# Altium project Power_Supply.PrjPcb
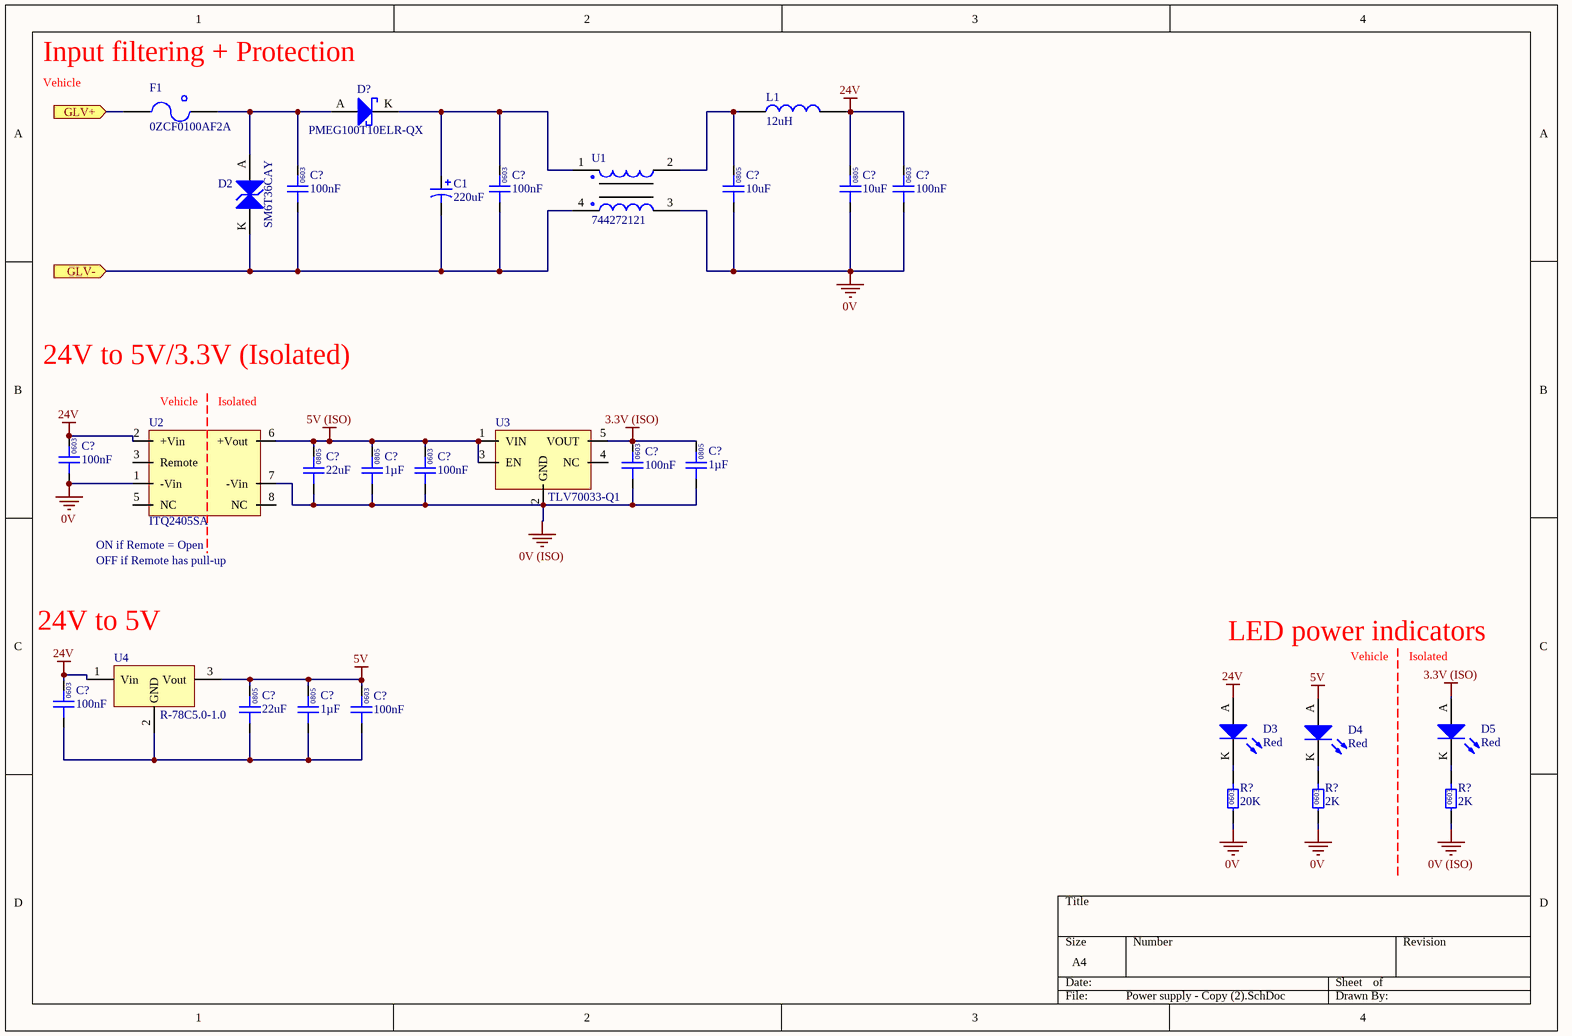
[diagram p0: Power supply - Copy (2).SchDoc]
1 sheet, 30 parts. Net scope: flat (ports and power ports of the same name join across sheets).
Board file: PCB1.PcbDoc

## Sheet Power supply - Copy (2).SchDoc
size A4; SheetNumber: 1; SheetTotal: 1

### Parts
(Parts that share a designator on the sheet are numbered #1, #2 ... from top to bottom, then left to right.)
C1  220uF  [Vishay Radial 1213]
C?#1  100nF  [0603]
C?#2  100nF  [0603]
C?#3  10uF  [0805]
C?#4  10uF  [0805]
C?#5  100nF  [0603]
C?#6  100nF  [0603]
C?#7  100nF  [0603]
C?#8  1µF  [0805]
C?#9  22uF  [0805]
C?#10  1µF  [0805]
C?#11  100nF  [0603]
C?#12  100nF  [0603]
C?#13  22uF  [0805]
C?#14  1µF  [0805]
C?#15  100nF  [0603]
D2  SM6T36CAY  [ST SMB DIODE]
D3  Red  [0805 LED]
D4  Red  [0805 LED]
D5  Red  [0805 LED]
D?  PMEG100T10ELR-QX  [NXP SOD123W]
F1  0ZCF0100AF2A  [2920]
L1  12uH  [1812]
R?#1  20K  [0603]
R?#2  2K  [0603]
R?#3  2K  [0603]
U1  744272121  [Wurth 4-PC Pad]
U2  ITQ2405SA  [8-SIP]
U3  TLV70033-Q1  [TI SOT-23-5]
U4  R-78C5.0-1.0  [RECOM 3-SIP]

### Ports
GLV+ (in), GLV- (in)

### Nets
0V: C?#3.1 C?#4.1 C?#5.1 C?#6.1 R?#1.1 R?#2.1 U1.3 U2.1(-Vin)
0V (ISO): C?#7.1 C?#8.1 C?#9.1 C?#10.1 C?#11.1 R?#3.1 U2.7(-Vin) U3.2(GND)
3.3V (ISO): C?#7.2 C?#8.2 D5.A U3.5(VOUT)
5V: C?#13.2 C?#14.2 C?#15.2 D4.A U4.3(Vout)
5V (ISO): C?#9.2 C?#10.2 C?#11.2 U2.6(+Vout) U3.1(VIN) U3.3(EN)
24V: C?#4.2 C?#5.2 C?#6.2 C?#12.2 D3.A L1.1 U2.2(+Vin) U4.1(Vin)
NetC1_1: C1.1 C?#1.1 C?#2.1 D2.K U1.4 ; port GLV-
NetC1_2: C1.2 C?#2.2 D?.K U1.1
NetC?#1_2: C?#1.2 D2.A D?.A F1.2
NetC?#3_2: C?#3.2 L1.2 U1.2
NetC?#12_1: C?#12.1 C?#13.1 C?#14.1 C?#15.1 U4.2(GND)
NetD3_K: D3.K R?#1.2
NetD4_K: D4.K R?#2.2
NetD5_K: D5.K R?#3.2
NetF1_1: F1.1 ; port GLV+

Not connected (* = marked no-connect by the designer): U2 3(Remote) 5(NC) 8(NC); U3 4(NC)

### Notes on the sheet
- Input filtering + Protection
- Vehicle
- 24V to 5V/3.3V (Isolated)
- (near U2) Vehicle
- (near U2) Isolated
- (near U2) ON if Remote = Open
- (near U2) OFF if Remote has pull-up
- 24V to 5V
- LED power indicators
- Isolated
- (in symbol GCM21BR71H105KA03L) 0805
- (in symbol GCM188L81H104KA57D) 0603
- (in symbol GRM21BR6YA106KE43L) 0805
- (in symbol GRM21BR61A226ME51L) 0805
- (in symbol RC0603FR-072KL) 0603
- (in symbol RC0603FR-0720KL) 0603

### Library data of the parts
C1 = MAL214699106E3: Manufacturer: Vishay; Rated Voltage: 50V; Tolerance: 20%; Material: Aluminium Electrolytic; Temperature Rating: 125C; Part Number: MAL214699106E3; Value: 220uF; Digikey Part Number: 4440PHCT-ND
C?#1 C?#2 C?#5-C?#7 C?#11 C?#12 C?#15 = GCM188L81H104KA57D: Manufacturer: muRata; Rated Voltage: 50V; Tolerance: ±10%; Material: MLCC; Temperature Rating: X8L; Part Number: GCM188L81H104KA57D; Value: 100nF; Digikey Part Number: 490-6049-1-ND
C?#3 C?#4 = GRM21BR6YA106KE43L: Manufacturer: muRata; Rated Voltage: 50V; Tolerance: 10%; Material: MLCC; Temperature Rating: X5R; Part Number: GRM21BR6YA106KE43L; Value: 10uF; Digikey Part Number: 490-10514-6-ND
C?#8 C?#10 C?#14 = GCM21BR71H105KA03L: Manufacturer: muRata; Rated Voltage: 50V; Tolerance: ±10%; Material: MLCC; Temperature Rating: X7R; Part Number: GCM21BR71H105KA03L; Value: 1µF; Digikey Part Number: 490-10675-1-ND
C?#9 C?#13 = GRM21BR61A226ME51L: Manufacturer: muRata; Rated Voltage: 10V; Tolerance: 20%; Material: MLCC; Temperature Rating: X5R; Part Number: GRM21BR61A226ME51L; Value: 22uF; Digikey Part Number: 490-10511-1-ND
D2 = SM6T36CAY: Manufacturer: STMicroelectronics; Forward Voltage: 30.8 V; Rated Power: 600W; Part Number: SM6T36CAY; Breakdown Voltage: 30.8 V; Digikey Part Number: 497-10804-1-ND
D3-D5 = SML-210LTT86: Red LED Indication - Discrete 1.75V 0805 (2012 Metric); Manufacturer: ROHM Semiconductor; Part Number: SML-210LTT86; Colour: Red; Digikey Part Number: 511-1286-1-ND
D? = PMEG100T10ELR-QX: Manufacturer: Nexperia USA Inc.; Forward Voltage: 0.75 V @ 1A; Breakdown Voltage: 100 V; Rated Power: 680 mW; Part Number: PMEG100T10ELR-QX; Digikey Part Number: 1727-PMEG100T10ELR-QXCT-ND
F1 = 0ZCF0100AF2A: PTC RESET FUSE 60V 1A 292; Manufacturer: Littelfuse Inc.; Part Number: 0ZCF0100AF2A; Digikey Part Number: 507-2070-1-ND; Digikey Link: https://www.digikey.com/product-detail/en/bel-fuse-inc/0ZCF0100AF2A/507-2070-1-ND/6210547
L1 = RLS-126: Manufacturer: Recom; Tolerance: 0.2; Material: Wirewound; Impedance: 230mOhm; Rated Current: 0.8 A; Part Number: RLS-126; Value: 12uH; Digikey Part Number: 945-3429-ND
R?#1 = RC0603FR-0720KL: Manufacturer: YAGEO; Tolerance: 0.01; Rated Power: 0.1W; Part Number: RC0603FR-0720KL; Value: 20K; Digikey Part Number: 311-20.0KHRCT-ND
R?#2 R?#3 = RC0603FR-072KL: Manufacturer: YAGEO; Tolerance: 0.01; Rated Power: 0.1W; Part Number: RC0603FR-072KL; Value: 2K; Digikey Part Number: 311-2.00KHRCT-ND
U1 = 744272121: Manufacturer: Wurth Electronics Inc; Value: 120uH @ 100kHz; Impedance: 460 Ohms @ 30MHz; Rated Current: 2.5 A; Part Number: 744272121; Material: Wirewound; Digikey Part Number: 732-1489-1-ND
U2 = ITQ2405SA: DC DC CONVERTER 5V 6W; Manufacturer: XP Power; Input Voltage: 9 to 36 V; Output Current: 1.2 A; Part Number: ITQ2405SA; Output Voltage: 5 V; Digikey Part Number: 1470-2858-5-ND
U3 = TLV70033-Q1: IC REG LINEAR 3.3V 200MA SOT23-5; Manufacturer: Texas Instruments; Input Voltage: 2 to 5.5 V; Output Current: 0.2 A; Part Number: TLV70033-Q1; Output Voltage: 3.3 V; Digikey Part Number: 296-27780-1-ND
U4 = R-78C5.0-1.0: CONV DC/DC 1A 5V OUT SIP VERT; Manufacturer: Recom; Input Voltage: 8 to 42 V; Output Current: 1.0 A; Part Number: R-78C5.0-1.0; Output Voltage: 5V; Digikey Part Number: 945-1395-5-ND